# Altium schematic sheet Audio-Beamformer_FPGA_V1.0.SchDoc: Audio-Beamformer
size A4; PageSetup: Record=PageOptions|CenterHorizontal=True|CenterVertical=True|PrintScale=0.97|XCorrection=1.00|YCorrection=1.00|PrintKind=0|BorderSize=5000000|LeftOffset=0|BottomOffset=0|Orientation=2|PaperLength=1000|PaperWidth=1000|Scale=100|PaperSource=7|PrintQuality=-3|MediaType=1|DitherType=10|PrintScaleMode=1|PaperKind=A4|PaperIndex=9; Organization: Ostschweizer Fachhochschule; Address2: Florian Baumgartner & Thierry Schwaller; Address3: florian.baumgartner@ost.ch; DocumentNumber: 4; Revision: V1.0; SheetNumber: 4; SheetTotal: 10; Author: Florian Baumgartner & Thierry Schwaller; Subtitle: FPGA
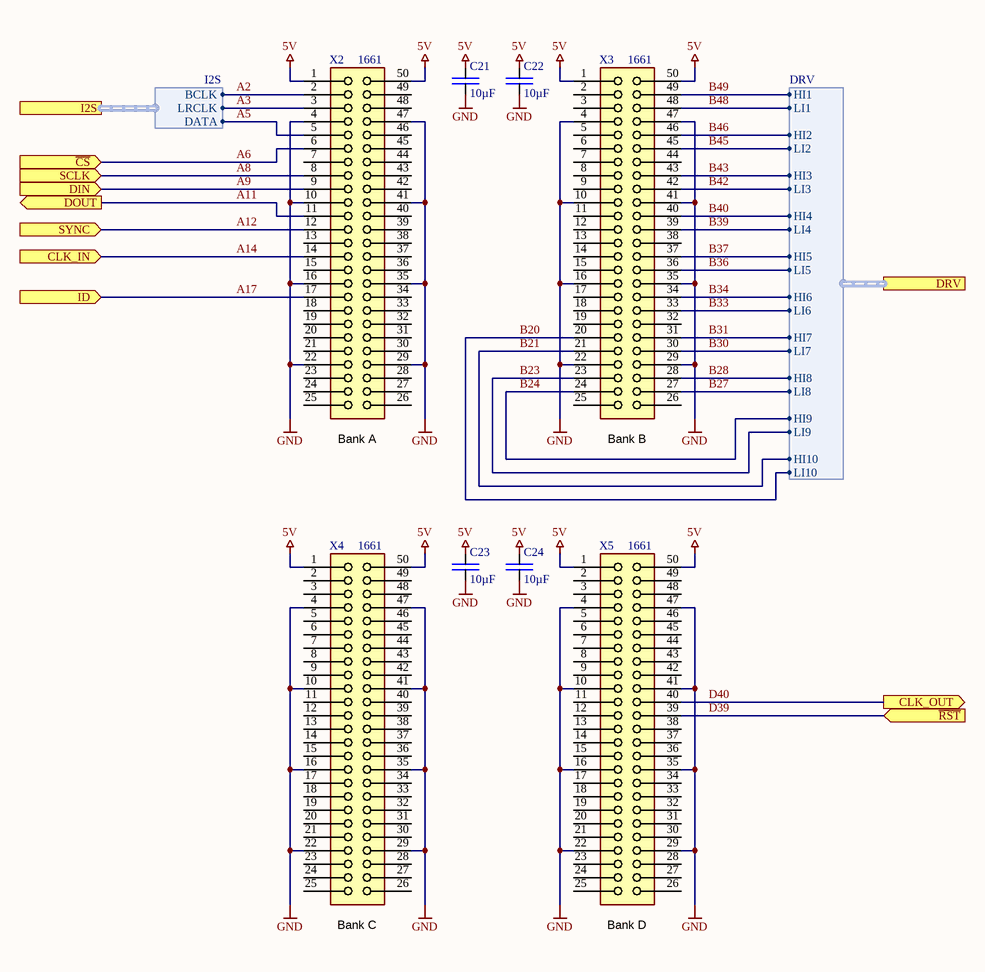
[diagram p0: Audio-Beamformer_FPGA_V1.0.SchDoc]

## Parts
C21  10µF  [SMD Keramikkondensator 1206]
C22  10µF  [SMD Keramikkondensator 1206]
C23  10µF  [SMD Keramikkondensator 1206]
C24  10µF  [SMD Keramikkondensator 1206]
X2  1661  [SMD Connector (1661)]
X3  1661  [SMD Connector (1661)]
X4  1661  [SMD Connector (1661)]
X5  1661  [SMD Connector (1661)]

## Ports
CLK_IN (in), CLK_OUT (out), DIN (in), DOUT (out), DRV (harness DRV), I2S (harness I2S), ID (in), SCLK (in), SYNC (in), ~{CS} (in), ~{RST} (in)

## Harnesses
I2S: BCLK, LRCLK, DATA
DRV: LI1, LI2, LI3, LI4, LI5, LI6, LI7, LI8, LI9, LI10, HI1, HI2, HI3, HI4, HI5, HI6, HI7, HI8, HI9, HI10

## Nets
5V: C21.2 C22.2 C23.2 C24.2 X2.1 X2.50 X3.1 X3.50 X4.1 X4.50 X5.1 X5.50
GND: C21.1 C22.1 C23.1 C24.1 X2.4 X2.10 X2.16 X2.22 X2.29 X2.35 X2.41 X2.47 X3.4 X3.10 X3.16 X3.22 X3.29 X3.35 X3.41 X3.47 X4.4 X4.10 X4.16 X4.22 X4.29 X4.35 X4.41 X4.47 X5.4 X5.10 X5.16 X5.22 X5.29 X5.35 X5.41 X5.47
A2: X2.2 ; port I2S.BCLK
A3: X2.3 ; port I2S.LRCLK
A5: X2.5 ; port I2S.DATA
A6: X2.6 ; port ~{CS}
A8: X2.8 ; port SCLK
A9: X2.9 ; port DIN
A11: X2.11 ; port DOUT
A12: X2.12 ; port SYNC
A14: X2.14 ; port CLK_IN
A17: X2.17 ; port ID
B20: X3.20 ; port DRV.LI10
B21: X3.21 ; port DRV.HI10
B23: X3.23 ; port DRV.LI9
B24: X3.24 ; port DRV.HI9
B27: X3.27 ; port DRV.LI8
B28: X3.28 ; port DRV.HI8
B30: X3.30 ; port DRV.LI7
B31: X3.31 ; port DRV.HI7
B33: X3.33 ; port DRV.LI6
B34: X3.34 ; port DRV.HI6
B36: X3.36 ; port DRV.LI5
B37: X3.37 ; port DRV.HI5
B39: X3.39 ; port DRV.LI4
B40: X3.40 ; port DRV.HI4
B42: X3.42 ; port DRV.LI3
B43: X3.43 ; port DRV.HI3
B45: X3.45 ; port DRV.LI2
B46: X3.46 ; port DRV.HI2
B48: X3.48 ; port DRV.LI1
B49: X3.49 ; port DRV.HI1
D39: X5.39 ; port ~{RST}
D40: X5.40 ; port CLK_OUT

Not connected (* = marked no-connect by the designer): X2 7 13 15 18 19 20 21 23 24 25 26 27 28 30 31 32 33 34 36 37 38 39 40 42 43 44 45 46 48 49; X3 2 3 5 6 7 8 9 11 12 13 14 15 17 18 19 25 26 32 38 44; X4 2 3 5 6 7 8 9 11 12 13 14 15 17 18 19 20 21 23 24 25 26 27 28 30 31 32 33 34 36 37 38 39 40 42 43 44 45 46 48 49; X5 2 3 5 6 7 8 9 11 12 13 14 15 17 18 19 20 21 23 24 25 26 27 28 30 31 32 33 34 36 37 38 42 43 44 45 46 48 49

## Notes on the sheet
- (near X2) Bank A
- (near X3) Bank B
- (near X4) Bank C
- (near X5) Bank D
- Title
- Author:
- Subtitle
- Date:
- Rev:
- File:
- Sheet
- of

## Library data of the parts
C21-C24 = C-CAPACITOR: CAP-MK; Component Description: Multilayer Ceramic Capacitors; Component Value: 10µF 50V; Digikey: 445-7886-1-ND; Farnell: 2211092; Mouser: 810-CGA5L3X5R1H106K; JLC-Parts: C13585; Unit Price: 0.27
X2-X5 = X-4UCON_1661: Board-to-Board Connector (Receptacle); Component Value: PRT-16890 (1661); Digikey: 1568-PRT-16890-ND; Mouser: 474-PRT-16890; ComponentLink1Description: Datasheet; ComponentLink1URL: http://www.4uconnector.com/online/object/4udrawing/19008.pdf; Component Description: Board-to-Board Connector (Receptacle); Unit Price: 1.60